# EAGLE design ENGI301_MID_02 (EAGLE 9.5.2)
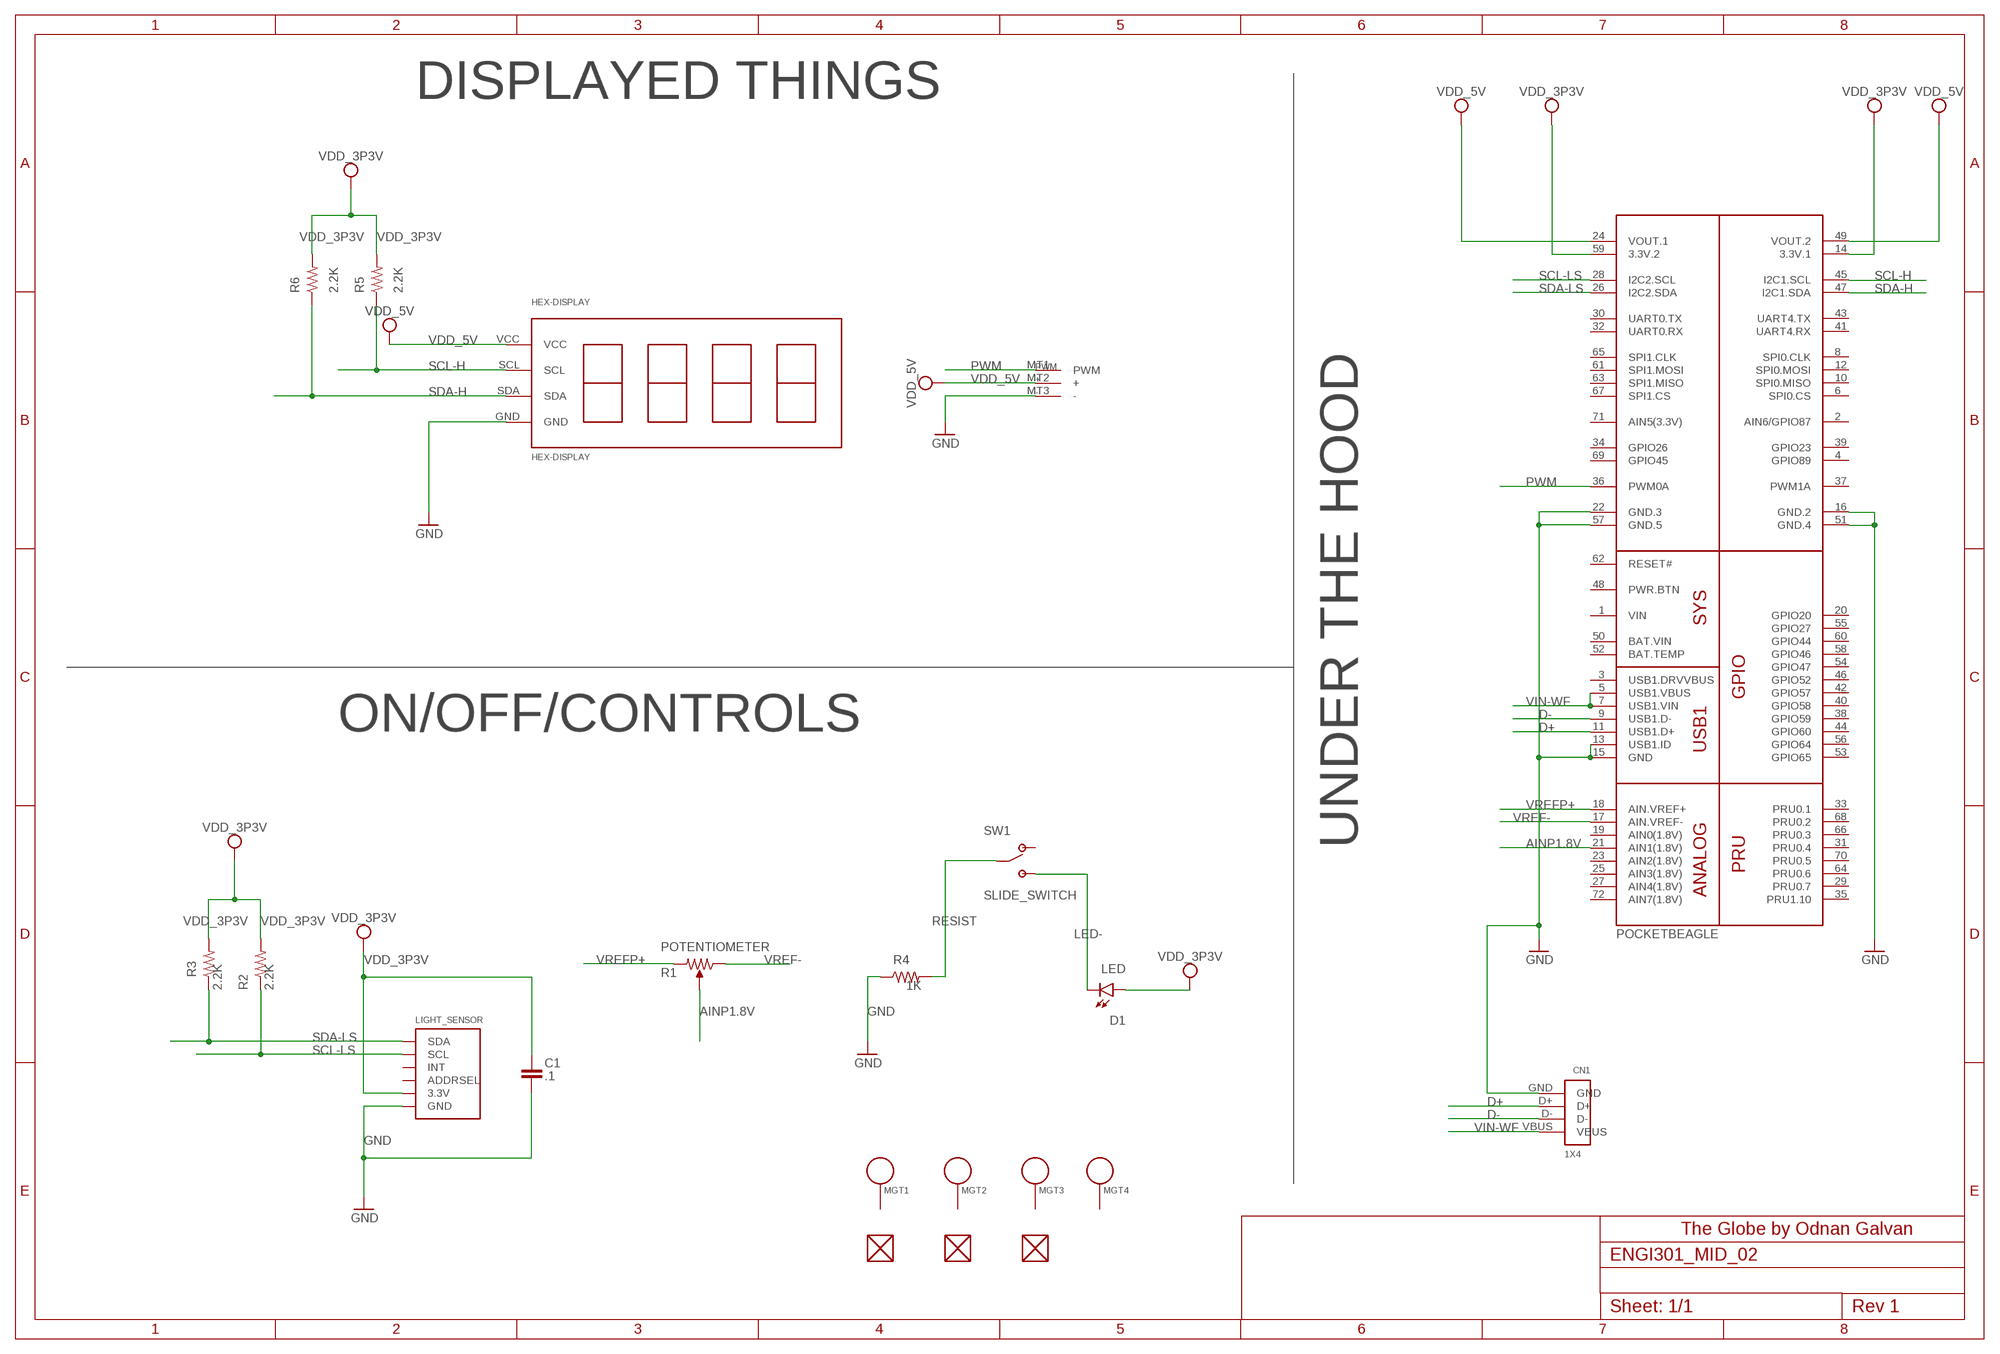
[diagram p0: schematic, sheet 1]

## Parts
C1  .1  C_C0603  [C0603]
CN1  1X4  [USBCONNECTOR]
D1  LED  [EIA-STD]
FUD1  FIDUCIAL  [FIDUCIAL_40MIL]
FUD2  FIDUCIAL  [FIDUCIAL_40MIL]
FUD3  FIDUCIAL  [FIDUCIAL_40MIL]
LIGHT_SENSOR  TSL2561  [TSL2561_FN]
MGT1  MOUNTING_HOLE  [MOUNTING_HOLE]
MGT2  MOUNTING_HOLE  [MOUNTING_HOLE]
MGT3  MOUNTING_HOLE  [MOUNTING_HOLE]
MGT4  MOUNTING_HOLE  [MOUNTING_HOLE]
R1  POTENTIOMETER  [POT-PO90S]
R2  2.2K  R_R0603  [R0603]
R3  2.2K  R_R0603  [R0603]
R4  1K  R_R0603  [R0603]
R5  2.2K  R_R0603  [R0603]
R6  2.2K  R_R0603  [R0603]
SW1  SLIDE_SWITCH  [JS202011SCQN]
U1  POCKETBEAGLE  [POCKETBEAGLE]
U$1  HEX-DISPLAY  [HEX-DISPLAY]
U$2  SERVO  [SERVO]

## Nets
AINP1.8V: R1.S U1.21(AIN1(1.8V))
D+: CN1.D+ U1.11(USB1.D+)
D-: CN1.D- U1.9(USB1.D-)
GND: C1.2 CN1.GND LIGHT_SENSOR.VSS(GND) R4.1 U1.13(USB1.ID) U1.15(GND) U1.16(GND.2) U1.22(GND.3) U1.51(GND.4) U1.57(GND.5) U$1.GND U$2.MT3(-)
LED-: D1.P$2(C) SW1.3(POS2) SW1.6(POS2)
PWM: U1.36(PWM0A) U$2.MT1(PWM)
RESIST: R4.2 SW1.2(COMM) SW1.5(COMM)
SCL-H: R5.1 U1.45(I2C1.SCL) U$1.SCL
SCL-LS: LIGHT_SENSOR.CLK(SCL) R2.1 U1.28(I2C2.SCL)
SDA-H: R6.1 U1.47(I2C1.SDA) U$1.SDA
SDA-LS: LIGHT_SENSOR.DATA(SDA) R3.1 U1.26(I2C2.SDA)
VDD_3P3V: C1.1 D1.P$1(A) LIGHT_SENSOR.VDD(3.3V) R2.2 R3.2 R5.2 R6.2 U1.14(3.3V.1) U1.59(3.3V.2)
VDD_5V: U1.24(VOUT.1) U1.49(VOUT.2) U$1.VCC U$2.MT2(+)
VIN-WF: CN1.VBUS U1.5(USB1.VBUS) U1.7(USB1.VIN)
VREF-: R1.CCW U1.17(AIN.VREF-)
VREFP+: R1.CW U1.18(AIN.VREF+)
Unconnected: FUD1.P$1 FUD2.P$1 FUD3.P$1 LIGHT_SENSOR.ADR(ADDRSEL) LIGHT_SENSOR.INT MGT1.P$1 MGT2.P$1 MGT3.P$1 MGT4.P$1 SW1.1(POS1) SW1.4(POS1) U1.2(AIN6/GPIO87) U1.3(USB1.DRVVBUS) U1.4(GPIO89) U1.6(SPI0.CS) U1.8(SPI0.CLK) U1.10(SPI0.MISO) U1.12(SPI0.MOSI) U1.19(AIN0(1.8V)) U1.20(GPIO20) U1.23(AIN2(1.8V)) U1.25(AIN3(1.8V)) U1.27(AIN4(1.8V)) U1.29(PRU0.7) U1.30(UART0.TX) U1.31(PRU0.4) U1.32(UART0.RX) U1.33(PRU0.1) U1.34(GPIO26) U1.35(PRU1.10) U1.37(PWM1A) U1.38(GPIO59) U1.39(GPIO23) U1.40(GPIO58) U1.41(UART4.RX) U1.42(GPIO57) U1.43(UART4.TX) U1.44(GPIO60) U1.46(GPIO52) U1.48(PWR.BTN) U1.52(BAT.TEMP) U1.53(GPIO65) U1.54(GPIO47) U1.55(GPIO27) U1.56(GPIO64) U1.58(GPIO46) U1.60(GPIO44) U1.61(SPI1.MOSI) U1.62(RESET#) U1.63(SPI1.MISO) U1.64(PRU0.6) U1.65(SPI1.CLK) U1.66(PRU0.3) U1.67(SPI1.CS) U1.68(PRU0.2) U1.69(GPIO45) U1.70(PRU0.5) U1.71(AIN5(3.3V)) U1.72(AIN7(1.8V))

## Notes on the sheet
- DISPLAYED THINGS
- ON/OFF/CONTROLS
- UNDER THE HOOD
- The Globe by Odnan Galvan
- 1/1

## Power pins joined to a net without a drawn wire
BAT.VIN: U1.50(BAT.VIN)
VIN: U1.1(VIN)

## Library data of the parts
C1 = ENGI301-1:C_: Capacitor SMD. Sizes: 0402, 0603 & 0805
CN1 = ENGI301_Mid_02:1X4: 4-pin connector
D1 = ENGI301-1:LED: LTST-C191TBKT Series of LEDs
FUD1-FUD3 = ENGI301-1:FIDUCIAL
LIGHT_SENSOR = ENGI301_Mid_02:TSL2561: TSL2561 Light-To-Digital Sensor Mouser Part Numbers: CS (obsolete): 856-TSL2561CS DFN (cheapest): 856-TSL2561FN
MGT1-MGT4 = ENGI301_Mid_02:MOUNTING_HOLE: Chassis Mounting Hole w/GND connection ability
R1 = ENGI301-1:POTENTIOMETER: Potentiometer - Examples: P090S-14T20BR10K (987-1277-ND)
R2-R6 = ENGI301-1:R_: RESISTOR, American symbol
SW1 = ENGI301-1:SLIDE_SWITCH: JS202011SCQN SPDT Slide Switch
U1 = ENGI301_Mid_02:POCKETBEAGLE
U$1 = ENGI301_Mid_02:HEX-DISPLAY
U$2 = ENGI301_Mid_02:SERVO

## Board
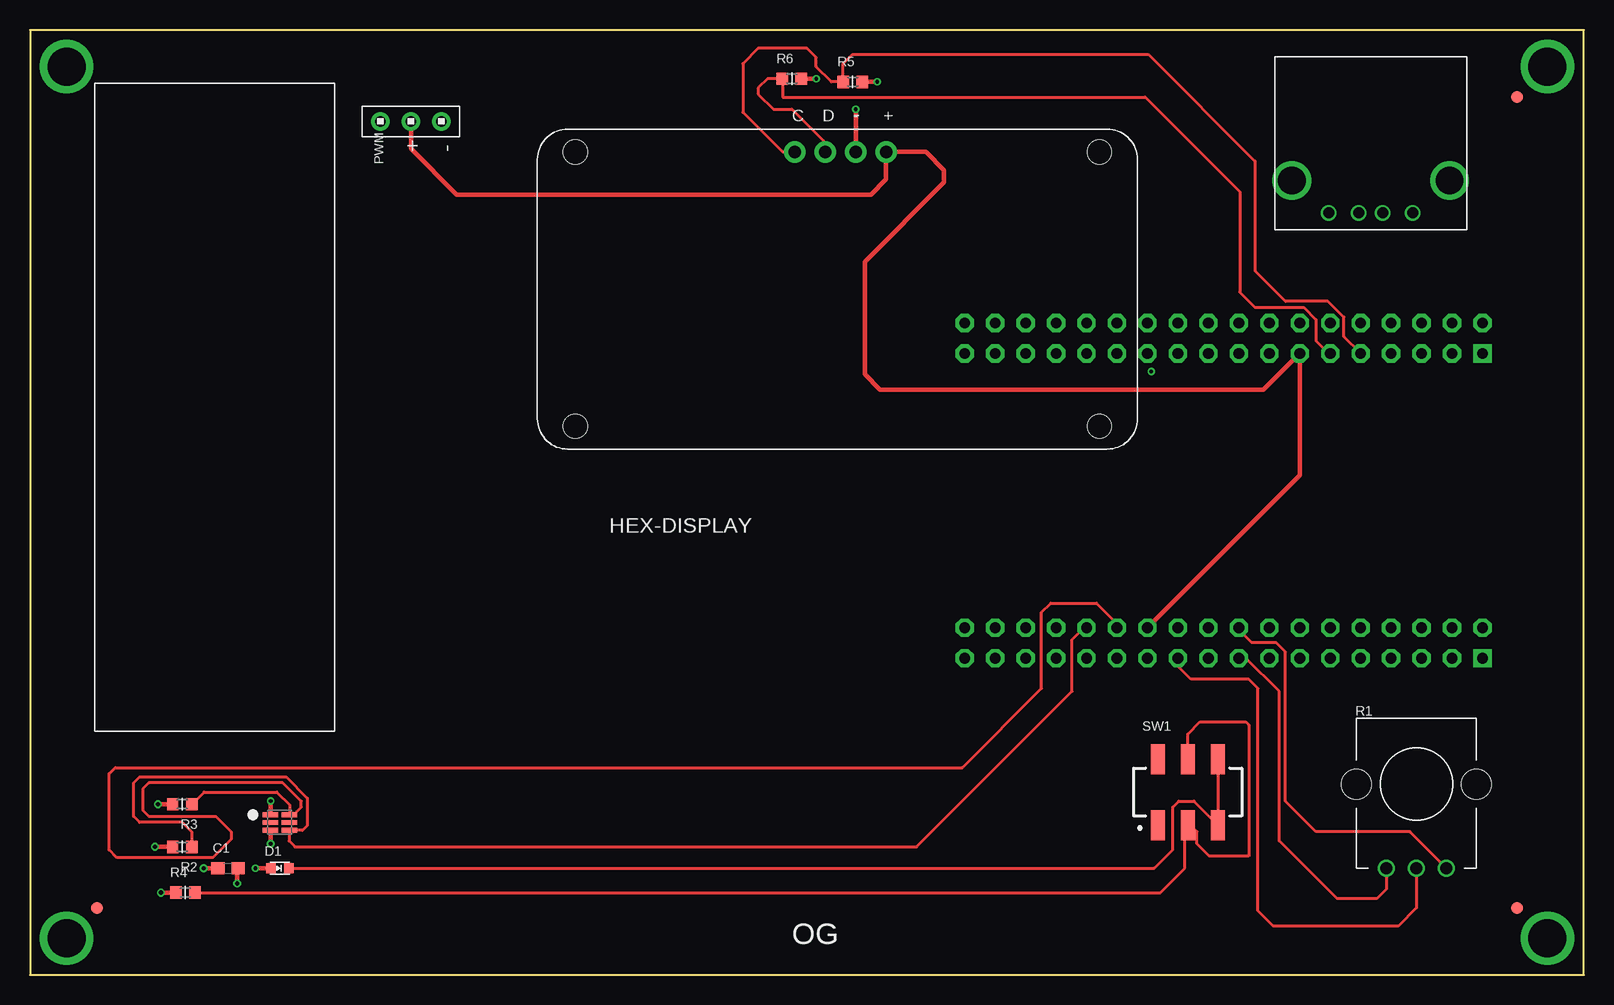
[diagram p1: board, top side]
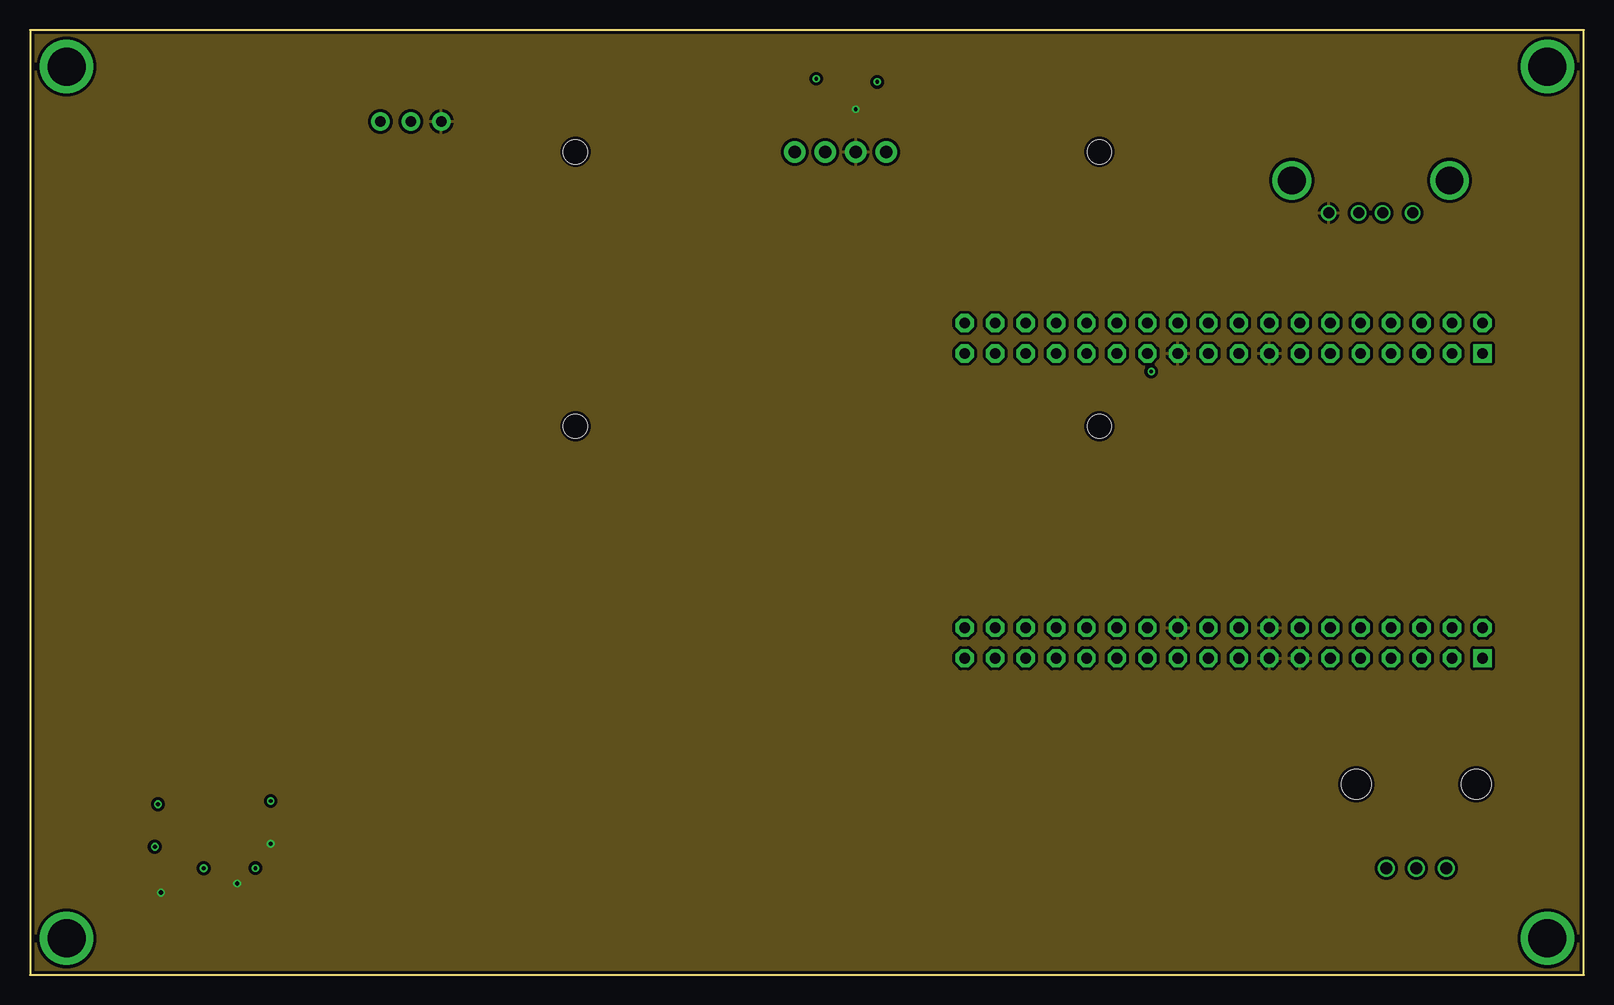
[diagram p2: board, inner layer Route2]
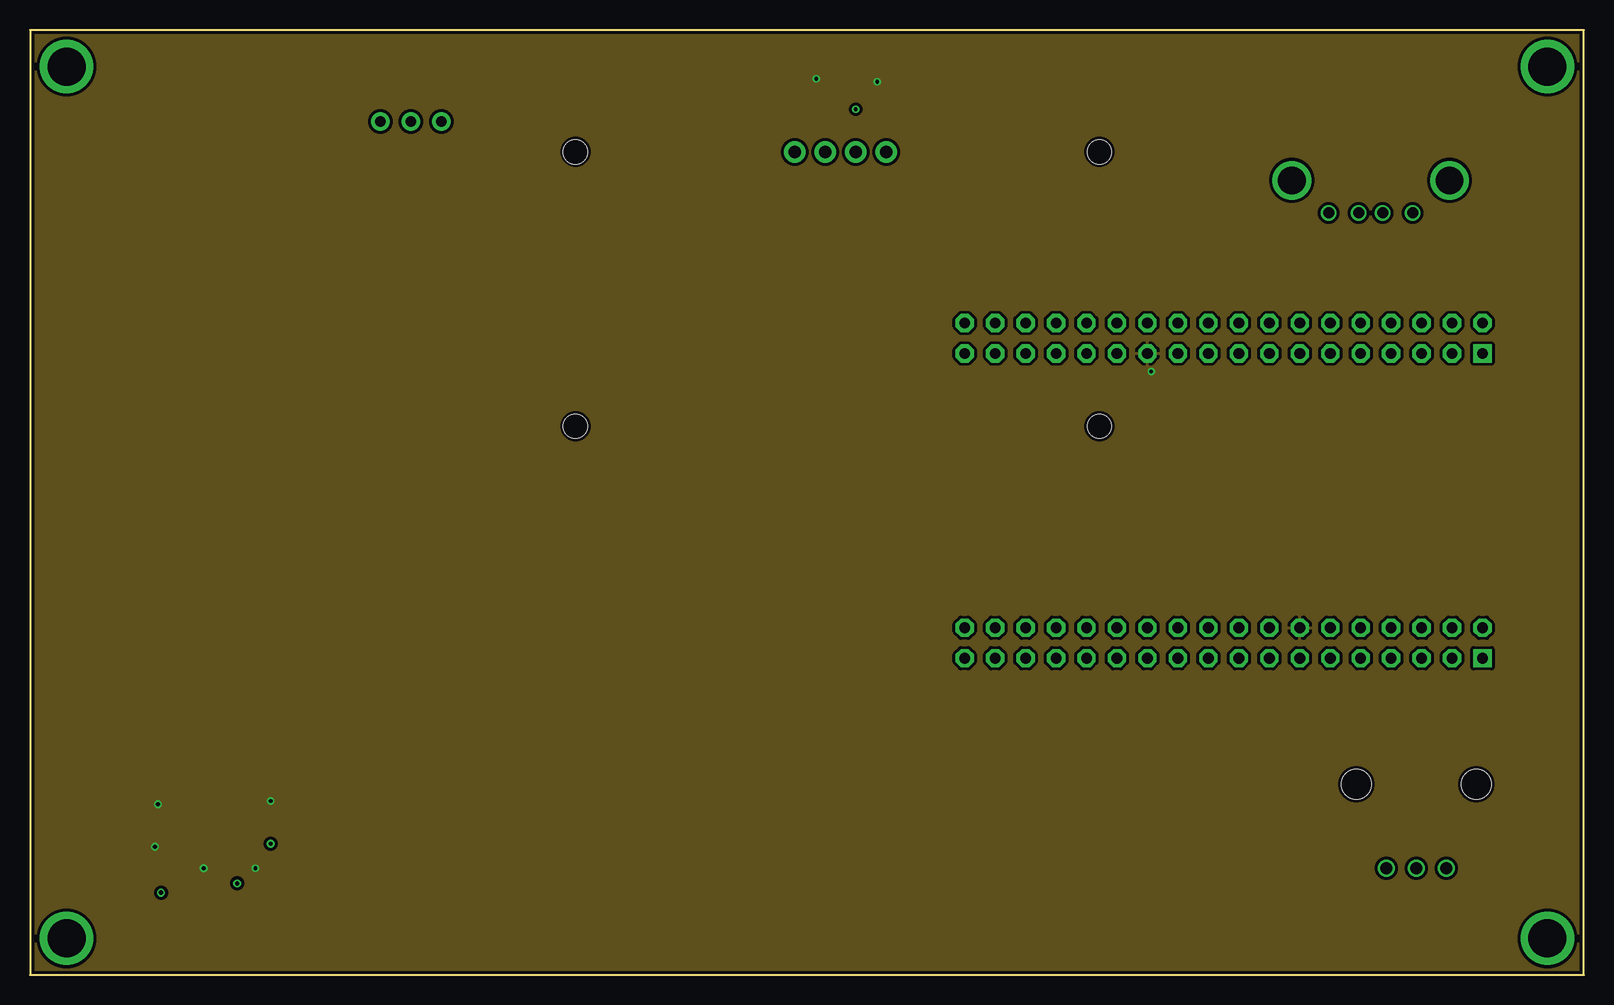
[diagram p3: board, inner layer Route15]
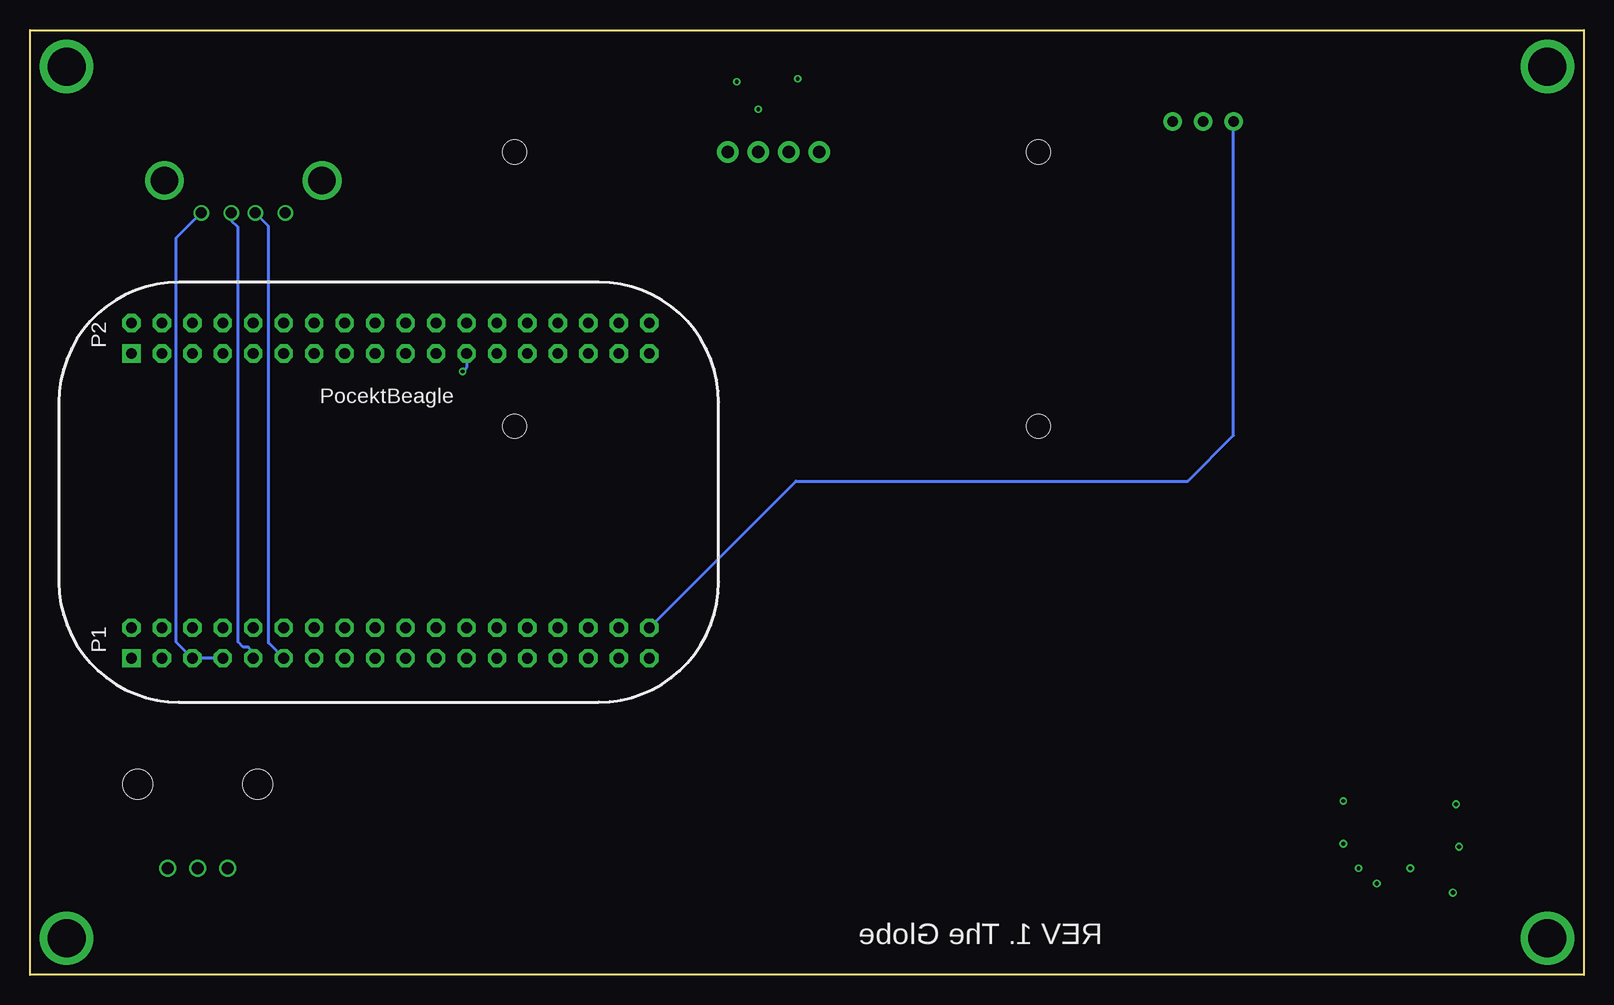
[diagram p4: board, bottom side, seen from below]

Size 129.54 x 78.74 mm. Coordinates in mm from the lower left corner, seen from the top.
Outline: 0,78.74 0,0 129.54,0 129.54,78.74 0,78.74
Copper layers (1*2*15*16): Top 0.035mm / dielectric 0.23mm / Route2 0.035mm / dielectric 0.93mm / Route15 0.035mm / dielectric 0.23mm / Bottom 0.035mm
Design rules "ENGI301_4lyr (1)": minimum track width 10mil, minimum drill 12mil, track to track 10mil, track to pad 10mil, pad to pad 10mil, via to via 10mil, smd to smd 10mil, copper to edge 10mil, drill to drill 12mil, minimum pad ring 6mil, minimum via ring 6mil, stop-mask expansion 3mil, vias tented up to drill 25mil, thermal gap 10mil

### Footprints (pad centres in the part's own frame; a part is rotated, then mirrored left to right if it is on the bottom)
C0603 = smd 1.1 x 1: 1 -0.85,0; 2 0.85,0
USBCONNECTOR = drill 0.92: D+ 1,0; D- -1,0; GND 3.5,0; VBUS -3.5,0 | drill 2.3: SHIELD_0 -6.57,-2.71; SHIELD_1 6.57,-2.71
EIA-STD = smd 0.8 x 0.8: P$1 -0.75,0; P$2 0.75,0
FIDUCIAL_40MIL = smd 1.016 x 1.016: P$1 0,0
TSL2561_FN = smd 1.3 x 0.4: ADR -0.8,0; CLK 0.8,-0.65; DATA 0.8,0.65; INT 0.8,0; VDD -0.8,0.65; VSS -0.8,-0.65
MOUNTING_HOLE = drill 3.175 pad 4.445: P$1 0,0
POT-PO90S = drill 1: CCW -2.5,0; CW 2.5,0; S 0,0 | hole 2.5: -5,7; 5,7
R0603 = smd 0.95 x 1.031: 1 -0.8,0; 2 0.8,0
JS202011SCQN = smd 1.2 x 2.5: 1 -2.5,-2.75; 2 0,-2.75; 3 2.5,-2.75; 4 -2.5,2.75; 5 0,2.75; 6 2.5,2.75
POCKETBEAGLE = drill 0.889 pad 1.524 square: 1 5.91,3.53; 37 5.91,28.93 | drill 0.889 pad 1.524 octagon: 2 5.91,6.07; 3 8.45,3.53; 4 8.45,6.07; 5 10.99,3.53; 6 10.99,6.07; 7 13.53,3.53; 8 13.53,6.07; 9 16.07,3.53; 10 16.07,6.07; 11 18.61,3.53; 12 18.61,6.07; 13 21.15,3.53; 14 21.15,6.07; 15 23.69,3.53; 16 23.69,6.07; 17 26.23,3.53; 18 26.23,6.07; 19 28.77,3.53; 20 28.77,6.07; 21 31.31,3.53; 22 31.31,6.07; 23 33.85,3.53; 24 33.85,6.07; 25 36.39,3.53; 26 36.39,6.07; 27 38.93,3.53; 28 38.93,6.07; 29 41.47,3.53; 30 41.47,6.07; 31 44.01,3.53; 32 44.01,6.07; 33 46.55,3.53; 34 46.55,6.07; 35 49.09,3.53; 36 49.09,6.07; 38 5.91,31.47; 39 8.45,28.93; 40 8.45,31.47; 41 10.99,28.93; 42 10.99,31.47; 43 13.53,28.93; 44 13.53,31.47; 45 16.07,28.93; 46 16.07,31.47; 47 18.61,28.93; 48 18.61,31.47; 49 21.15,28.93; 50 21.15,31.47; 51 23.69,28.93; 52 23.69,31.47; 53 26.23,28.93; 54 26.23,31.47; 55 28.77,28.93; 56 28.77,31.47; 57 31.31,28.93; 58 31.31,31.47; 59 33.85,28.93; 60 33.85,31.47; 61 36.39,28.93; 62 36.39,31.47; 63 38.93,28.93; 64 38.93,31.47; 65 41.47,28.93; 66 41.47,31.47; 67 44.01,28.93; 68 44.01,31.47; 69 46.55,28.93; 70 46.55,31.47; 71 49.09,28.93; 72 49.09,31.47
HEX-DISPLAY = drill 1.016 pad 1.778: GND 1.524,11.43; SCL -3.556,11.43; SDA -1.016,11.43; VCC 4.064,11.43 | hole 2: -21.844,11.43; -21.844,-11.43; 21.844,11.43; 21.844,-11.43
SERVO = drill 0.889 pad 1.524: MT1 50.8,-3.81; MT2 50.8,-6.35; MT3 50.8,-8.89

### Placement (x,y rotation side)
C1  16.51,8.89 0 top
CN1  111.76,63.5 180 top
D1  20.83,8.89 0 top
FUD1  5.59,5.59 0 top
FUD2  123.95,5.59 0 top
FUD3  123.95,73.15 0 top
LIGHT_SENSOR  20.83,12.7 0 top
MGT1  3.05,3.05 0 top
MGT2  126.49,3.05 0 top
MGT3  3.05,75.69 0 top
MGT4  126.49,75.69 0 top
R1  115.57,8.89 0 top
R2  12.7,10.67 180 top
R3  12.7,14.22 180 top
R4  12.95,6.86 0 top
R5  68.58,74.42 0 top
R6  63.5,74.68 0 top
SW1  96.52,15.24 0 top
U1  127,22.86 0 bottom
U$1  67.31,57.15 0 top
U$2  25.4,20.32 90 top

### Tracks (layer width: path | path; a pad name or v marks a point on that pad's centre or on a via)
AINP1.8V
  Top 0.254: R1.S 115.57,5.59 114.05,4.06 103.63,4.06 102.36,5.33 102.36,23.88 101.6,24.64 96.77,24.64 95.69,25.72 U1.21
D+
  Bottom 0.254: U1.11 109.66,27.66 109.66,62.4 CN1.D+
D-
  Bottom 0.254: CN1.D- 112.76,62.87 112.2,62.3 112.2,27.75 111.76,27.3 111.34,27.3 110.93,26.9 U1.9
GND  (via drill 0.3 pad 0.61, 0.35)
  Top 0.254: 17.27,8.8 C1.2 | LIGHT_SENSOR.VSS 20.07,12.01
  Top 0.381: R4.1 v10.92,6.86 | v17.27,7.62 17.27,8.8 | U$1.GND v68.83,72.14 | 20.07,12.01 v20.07,10.92
  pour Route2: -2.54,81.28 -2.54,-2.54 132.08,-2.54 132.08,81.28
LED-
  Top 0.254: D1.P$2 93.73,8.89 95.25,10.41 95.25,13.97 95.76,14.48 97.03,14.48 SW1.3 SW1.6
PWM
  Bottom 0.254: U1.36 65.69,41.15 33.02,41.15 29.21,44.96 U$2.MT1
RESIST
  Top 0.254: R4.2 94.23,6.86 96.27,8.89 96.27,12.19 96.54,12.47 | SW1.5 96.52,20.07 97.54,21.08 101.35,21.08 101.6,20.83 101.6,9.91 98.3,9.91 97.28,10.92 97.28,11.94 96.75,12.47 96.54,12.47 | SW1.2 96.54,12.47
SCL-H
  Top 0.254: U$1.SCL 62.74,68.58 59.44,71.88 59.44,75.95 60.71,77.22 64.77,77.22 65.53,76.45 65.53,75.69 66.8,74.42 R5.1 67.78,75.91 68.58,76.71 93.22,76.71 102.11,67.82 102.11,58.67 104.65,56.13 108.2,56.13 109.53,54.8 109.53,53.19 U1.45
SCL-LS
  Top 0.254: R2.1 13.5,11.9 12.7,12.7 9.14,12.7 8.64,13.21 8.64,16 9.14,16.51 21.34,16.51 23.11,14.73 23.11,12.45 22.72,12.05 LIGHT_SENSOR.CLK 21.59,12.01 21.59,11.18 22.1,10.67 73.91,10.67 86.87,23.62 86.87,27.94 87.86,28.93 U1.28
SDA-H
  Top 0.254: U$1.SDA 66.29,69.34 63.5,72.14 61.98,72.14 60.71,73.41 60.71,73.91 61.47,74.68 R6.1 62.74,74.64 62.74,73.15 92.96,73.15 100.84,65.28 100.84,56.9 102.11,55.63 106.17,55.63 107.19,54.61 107.19,52.83 108.23,51.79 U1.47
SDA-LS
  Top 0.254: R3.1 14.52,15.24 20.57,15.24 21.63,14.19 LIGHT_SENSOR.DATA 21.99,13.35 22.61,13.97 22.61,14.48 21.08,16 9.91,16 9.4,15.49 9.4,13.72 9.91,13.21 15.49,13.21 16.76,11.94 16.76,11.3 15.24,9.77 7.25,9.77 6.6,10.41 6.6,16.76 7.11,17.27 77.72,17.27 84.33,23.88 84.33,30.23 85.09,30.99 88.9,30.99 90.61,29.28 U1.26
VDD_3P3V  (via drill 0.3 pad 0.61, 0.35)
  Top 0.254: LIGHT_SENSOR.VDD 20.07,13.39
  Top 0.381: C1.1 v14.48,8.89 | R3.2 v10.67,14.22 | R2.2 v10.41,10.67 | D1.P$1 v18.8,8.89 | R6.2 v65.53,74.68 | R5.2 v70.61,74.42 | 20.07,13.39 v20.07,14.48
  Bottom 0.254: U1.59 93.15,50.61 v93.47,50.29
  pour Route15: -5.08,83.82 -5.08,-5.08 134.62,-5.08 134.62,83.82
VDD_5V
  Top 0.381: U1.24 105.85,41.63 U1.49 102.83,48.77 70.87,48.77 69.6,50.04 69.6,59.44 76.2,66.04 76.2,67.06 74.68,68.58 U$1.VCC 71.37,66.29 70.1,65.02 35.56,65.02 31.75,68.83 U$2.MT2
VIN-WF
  Bottom 0.254: U1.7 U1.5 117.35,27.73 117.35,61.41 CN1.VBUS
VREF-
  Top 0.254: R1.CCW 113.07,7.15 112.27,6.35 108.97,6.35 104.14,11.18 104.14,23.62 101.37,26.39 U1.17
VREFP+
  Top 0.254: R1.CW 115.02,11.94 107.19,11.94 104.65,14.48 104.65,26.92 103.89,27.69 101.85,27.69 100.77,28.77 U1.18

### Text on the board
tNames: OG
bNames: REV 1. The Globe